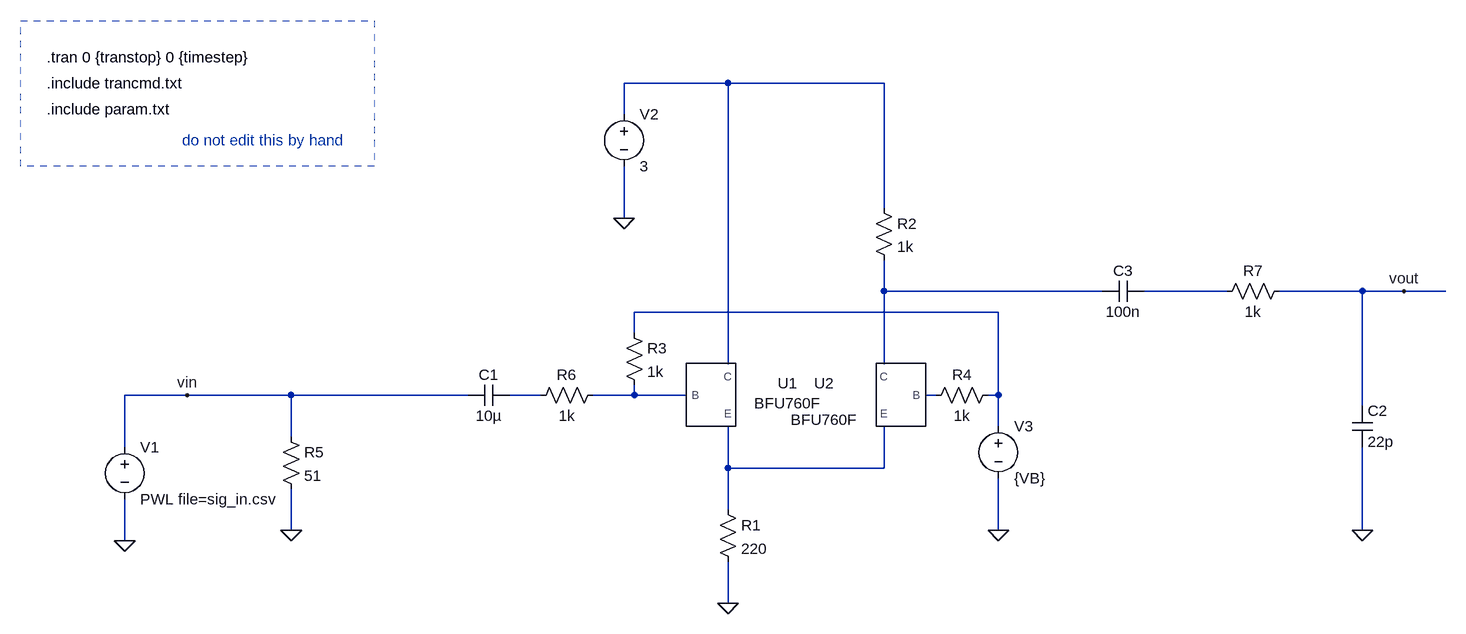
[diagram p0: schematic vca_01.asc]
vca_01.asc, the LTspice schematic file:
Version 4
SHEET 1 25452 10420
WIRE 18864 5920 18704 5920
WIRE 19104 5920 18864 5920
WIRE 18704 5968 18704 5920
WIRE 19104 6112 19104 5920
WIRE 18704 6128 18704 6048
WIRE 19104 6240 19104 6192
WIRE 19440 6240 19104 6240
WIRE 19632 6240 19504 6240
WIRE 19840 6240 19712 6240
WIRE 19904 6240 19840 6240
WIRE 19968 6240 19904 6240
WIRE 19280 6272 18720 6272
WIRE 18720 6304 18720 6272
WIRE 18864 6352 18864 5920
WIRE 19104 6352 19104 6240
WIRE 18032 6400 17936 6400
WIRE 18192 6400 18032 6400
WIRE 18464 6400 18192 6400
WIRE 18576 6400 18528 6400
WIRE 18720 6400 18720 6384
WIRE 18720 6400 18656 6400
WIRE 18800 6400 18720 6400
WIRE 19184 6400 19168 6400
WIRE 19280 6400 19280 6272
WIRE 19280 6400 19264 6400
WIRE 19840 6416 19840 6240
WIRE 19280 6448 19280 6400
WIRE 18192 6464 18192 6400
WIRE 17936 6480 17936 6400
WIRE 18864 6512 18864 6448
WIRE 19104 6512 19104 6448
WIRE 19104 6512 18864 6512
WIRE 18864 6576 18864 6512
WIRE 18192 6608 18192 6544
WIRE 19280 6608 19280 6528
WIRE 19840 6608 19840 6480
WIRE 17936 6624 17936 6560
WIRE 18864 6720 18864 6656
FLAG 18032 6400 vin
FLAG 17936 6624 0
FLAG 19904 6240 vout
FLAG 18864 6720 0
FLAG 18704 6128 0
FLAG 19280 6608 0
FLAG 18192 6608 0
FLAG 19840 6608 0
SYMBOL voltage 17936 6464 R0
WINDOW 39 0 0 Left 0
SYMATTR InstName V1
SYMATTR Value PWL file=sig_in.csv
SYMBOL BFU760F 18832 6400 R0
SYMATTR InstName U1
SYMBOL BFU760F 19136 6400 M0
WINDOW 3 124 22 Top 2
SYMATTR InstName U2
SYMBOL res 18848 6560 R0
SYMATTR InstName R1
SYMATTR Value 220
SYMBOL voltage 18704 5952 R0
SYMATTR InstName V2
SYMATTR Value 3
SYMBOL res 19088 6096 R0
SYMATTR InstName R2
SYMATTR Value 1k
SYMBOL voltage 19280 6432 R0
SYMATTR InstName V3
SYMATTR Value {VB}
SYMBOL cap 18528 6384 R90
WINDOW 0 0 32 VBottom 2
WINDOW 3 32 32 VTop 2
SYMATTR InstName C1
SYMATTR Value 10µ
SYMBOL res 18704 6288 R0
SYMATTR InstName R3
SYMATTR Value 1k
SYMBOL res 19280 6384 R90
WINDOW 0 0 56 VBottom 2
WINDOW 3 32 56 VTop 2
SYMATTR InstName R4
SYMATTR Value 1k
SYMBOL res 18176 6448 R0
SYMATTR InstName R5
SYMATTR Value 51
SYMBOL res 18672 6384 R90
WINDOW 0 0 56 VBottom 2
WINDOW 3 32 56 VTop 2
SYMATTR InstName R6
SYMATTR Value 1k
SYMBOL cap 19824 6416 R0
SYMATTR InstName C2
SYMATTR Value 22p
SYMBOL cap 19504 6224 R90
WINDOW 0 0 32 VBottom 2
WINDOW 3 32 32 VTop 2
SYMATTR InstName C3
SYMATTR Value 100n
SYMBOL res 19728 6224 R90
WINDOW 0 0 56 VBottom 2
WINDOW 3 32 56 VTop 2
SYMATTR InstName R7
SYMATTR Value 1k
TEXT 17816 5880 Left 2 !.tran 0 {transtop} 0 {timestep}
TEXT 17816 5960 Left 2 !.include param.txt
TEXT 17816 5920 Left 2 !.include trancmd.txt
TEXT 18024 6008 Left 2 ;do not edit this by hand
RECTANGLE Normal 18320 6048 17776 5824 2

The netlist it stands for:
* vca_01.asc
V1 vin 0 PWL file=sig_in.csv
XU1 N001 N006 N008 BFU760F  ; pins C B E
XU2 N002 N007 N008 BFU760F  ; pins C B E
R1 N008 0 220
V2 N001 0 3
R2 N001 N002 1k
V3 N004 0 {VB}
C1 N005 vin 10µ
R3 N004 N006 1k
R4 N004 N007 1k
R5 vin 0 51
R6 N006 N005 1k
C2 vout 0 22p
C3 N003 N002 100n
R7 vout N003 1k
.tran 0 {transtop} 0 {timestep}
.include param.txt
.include trancmd.txt
* do not edit this by hand
.lib BFU760F.txt
.backanno
.end